# EAGLE design manpad (EAGLE 7.5.0)

## Sheet 1 of 5: MPU MAIN
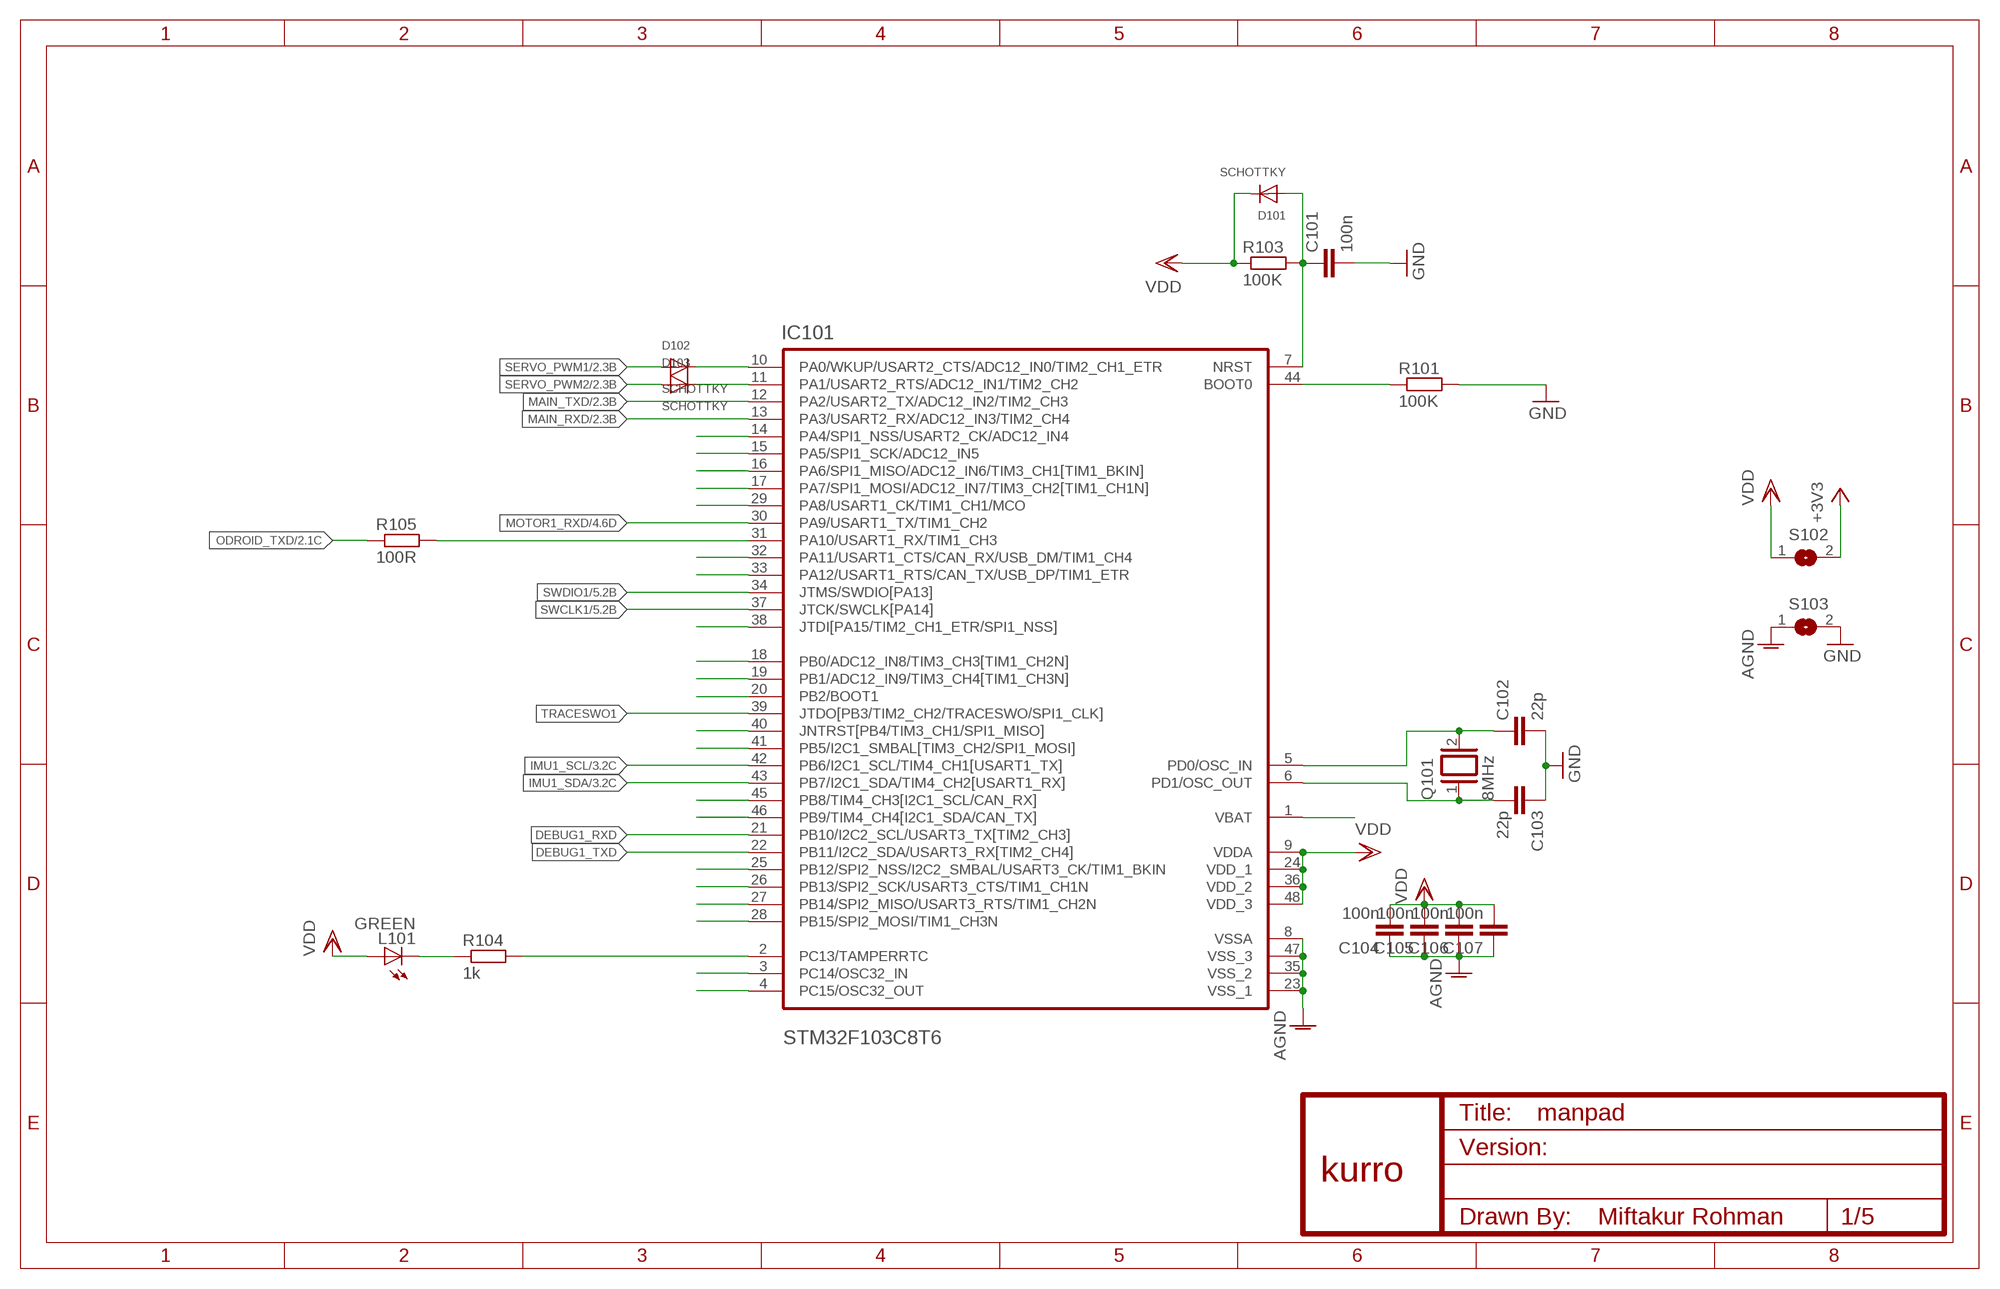
[diagram p0: schematic, sheet 1]

### Parts
C101  100n  C-EUC0603  [C0603]
C102  22p  C-EUC0603  [C0603]
C103  22p  C-EUC0603  [C0603]
C104  100n  C-EUC0603  [C0603]
C105  100n  C-EUC0603  [C0603]
C106  100n  C-EUC0603  [C0603]
C107  100n  C-EUC0603  [C0603]
D101  SCHOTTKY  DIODESOD-323F  [SOD-323F]
D102  SCHOTTKY  DIODESOD-323F  [SOD-323F]
D103  SCHOTTKY  DIODESOD-323F  [SOD-323F]
IC101  STM32F103C8T6  [QFP50P900X900X160-48N]
L101  GREEN  LEDCHIP-LED0805  [CHIP-LED0805]
Q101  8MHz  XTAL/S  [QS]
R101  100K  R-EU_R0603  [R0603]
R103  100K  R-EU_R0603  [R0603]
R104  1k  R-EU_R0603  [R0603]
R105  100R  R-EU_R0603  [R0603]
S102  SJS  [SJS]
S103  SJS  [SJS]
U$1  KURRO_FOOTPRINT  [KURRO-LOGO]

### Nets
+3V3: S102.2 ; also sheet 2,3,4,5
AGND [ic]: C104.1 C105.1 C106.1 C107.1 IC101.8(VSSA) IC101.23(VSS_1) IC101.35(VSS_2) IC101.47(VSS_3) S103.1 ; also sheet 2
DEBUG1_RXD [ic]: IC101.21(PB10/I2C2_SCL/USART3_TX[TIM2_CH3])
DEBUG1_TXD [ic]: IC101.22(PB11/I2C2_SDA/USART3_RX[TIM2_CH4])
GND: C101.2 C102.2 C103.1 R101.2 S103.2 ; also sheet 2,3,4,5
IMU1_SCL [ic]: IC101.42(PB6/I2C1_SCL/TIM4_CH1[USART1_TX]) ; also sheet 3
IMU1_SDA [ic]: IC101.43(PB7/I2C1_SDA/TIM4_CH2[USART1_RX]) ; also sheet 3
LED1_BUILTIN [ic]: IC101.2(PC13/TAMPERRTC) R104.2
MAIN_RXD [ic]: IC101.13(PA3/USART2_RX/ADC12_IN3/TIM2_CH4) ; also sheet 2,5
MAIN_TXD [ic]: IC101.12(PA2/USART2_TX/ADC12_IN2/TIM2_CH3) ; also sheet 2,5
MOTOR1_RXD [ic]: IC101.30(PA9/USART1_TX/TIM1_CH2) ; also sheet 4
N$2 [ic]: IC101.45(PB8/TIM4_CH3[I2C1_SCL/CAN_RX])
N$4 [ic]: IC101.44(BOOT0) R101.1
N$5 [ic]: IC101.20(PB2/BOOT1)
N$6 [ic]: C103.2 IC101.6(PD1/OSC_OUT) Q101.1
N$7 [ic]: C102.1 IC101.5(PD0/OSC_IN) Q101.2
N$8 [ic]: IC101.46(PB9/TIM4_CH4[I2C1_SDA/CAN_TX])
N$9 [ic]: L101.C R104.1
N$40 [ic]: IC101.14(PA4/SPI1_NSS/USART2_CK/ADC12_IN4)
N$41 [ic]: IC101.15(PA5/SPI1_SCK/ADC12_IN5)
N$42 [ic]: IC101.16(PA6/SPI1_MISO/ADC12_IN6/TIM3_CH1[TIM1_BKIN])
N$43 [ic]: IC101.17(PA7/SPI1_MOSI/ADC12_IN7/TIM3_CH2[TIM1_CH1N])
N$44 [ic]: IC101.29(PA8/USART1_CK/TIM1_CH1/MCO)
N$45 [ic]: IC101.32(PA11/USART1_CTS/CAN_RX/USB_DM/TIM1_CH4)
N$46 [ic]: IC101.33(PA12/USART1_RTS/CAN_TX/USB_DP/TIM1_ETR)
N$47 [ic]: IC101.38(JTDI[PA15/TIM2_CH1_ETR/SPI1_NSS])
N$48 [ic]: IC101.18(PB0/ADC12_IN8/TIM3_CH3[TIM1_CH2N])
N$49 [ic]: IC101.19(PB1/ADC12_IN9/TIM3_CH4[TIM1_CH3N])
N$50 [ic]: IC101.40(JNTRST[PB4/TIM3_CH1/SPI1_MISO])
N$51 [ic]: IC101.41(PB5/I2C1_SMBAL[TIM3_CH2/SPI1_MOSI])
N$52 [ic]: IC101.25(PB12/SPI2_NSS/I2C2_SMBAL/USART3_CK/TIM1_BKIN)
N$53 [ic]: IC101.26(PB13/SPI2_SCK/USART3_CTS/TIM1_CH1N)
N$54 [ic]: IC101.27(PB14/SPI2_MISO/USART3_RTS/TIM1_CH2N)
N$55 [ic]: IC101.28(PB15/SPI2_MOSI/TIM1_CH3N)
N$56 [ic]: IC101.3(PC14/OSC32_IN)
N$57 [ic]: IC101.4(PC15/OSC32_OUT)
N$58 [ic]: IC101.1(VBAT)
N$59 [ic]: IC101.31(PA10/USART1_RX/TIM1_CH3) R105.2
ODROID_TXD: R105.1 ; also sheet 2,4
PWM1_1 [ic]: D102.C IC101.10(PA0/WKUP/USART2_CTS/ADC12_IN0/TIM2_CH1_ETR)
PWM2_1 [ic]: D103.C IC101.11(PA1/USART2_RTS/ADC12_IN1/TIM2_CH2)
RST [ic]: C101.1 D101.A IC101.7(NRST) R103.2
SERVO_PWM1: D102.A ; also sheet 2,4,5
SERVO_PWM2: D103.A ; also sheet 2,4,5
SWCLK1 [ic]: IC101.37(JTCK/SWCLK[PA14]) ; also sheet 5
SWDIO1 [ic]: IC101.34(JTMS/SWDIO[PA13]) ; also sheet 5
TRACESWO1 [ic]: IC101.39(JTDO[PB3/TIM2_CH2/TRACESWO/SPI1_CLK])
VDD [ic]: C104.2 C105.2 C106.2 C107.2 D101.C IC101.9(VDDA) IC101.24(VDD_1) IC101.36(VDD_2) IC101.48(VDD_3) L101.A R103.1 S102.1 ; also sheet 2

## Sheet 2 of 5: MPU REDUNDANT
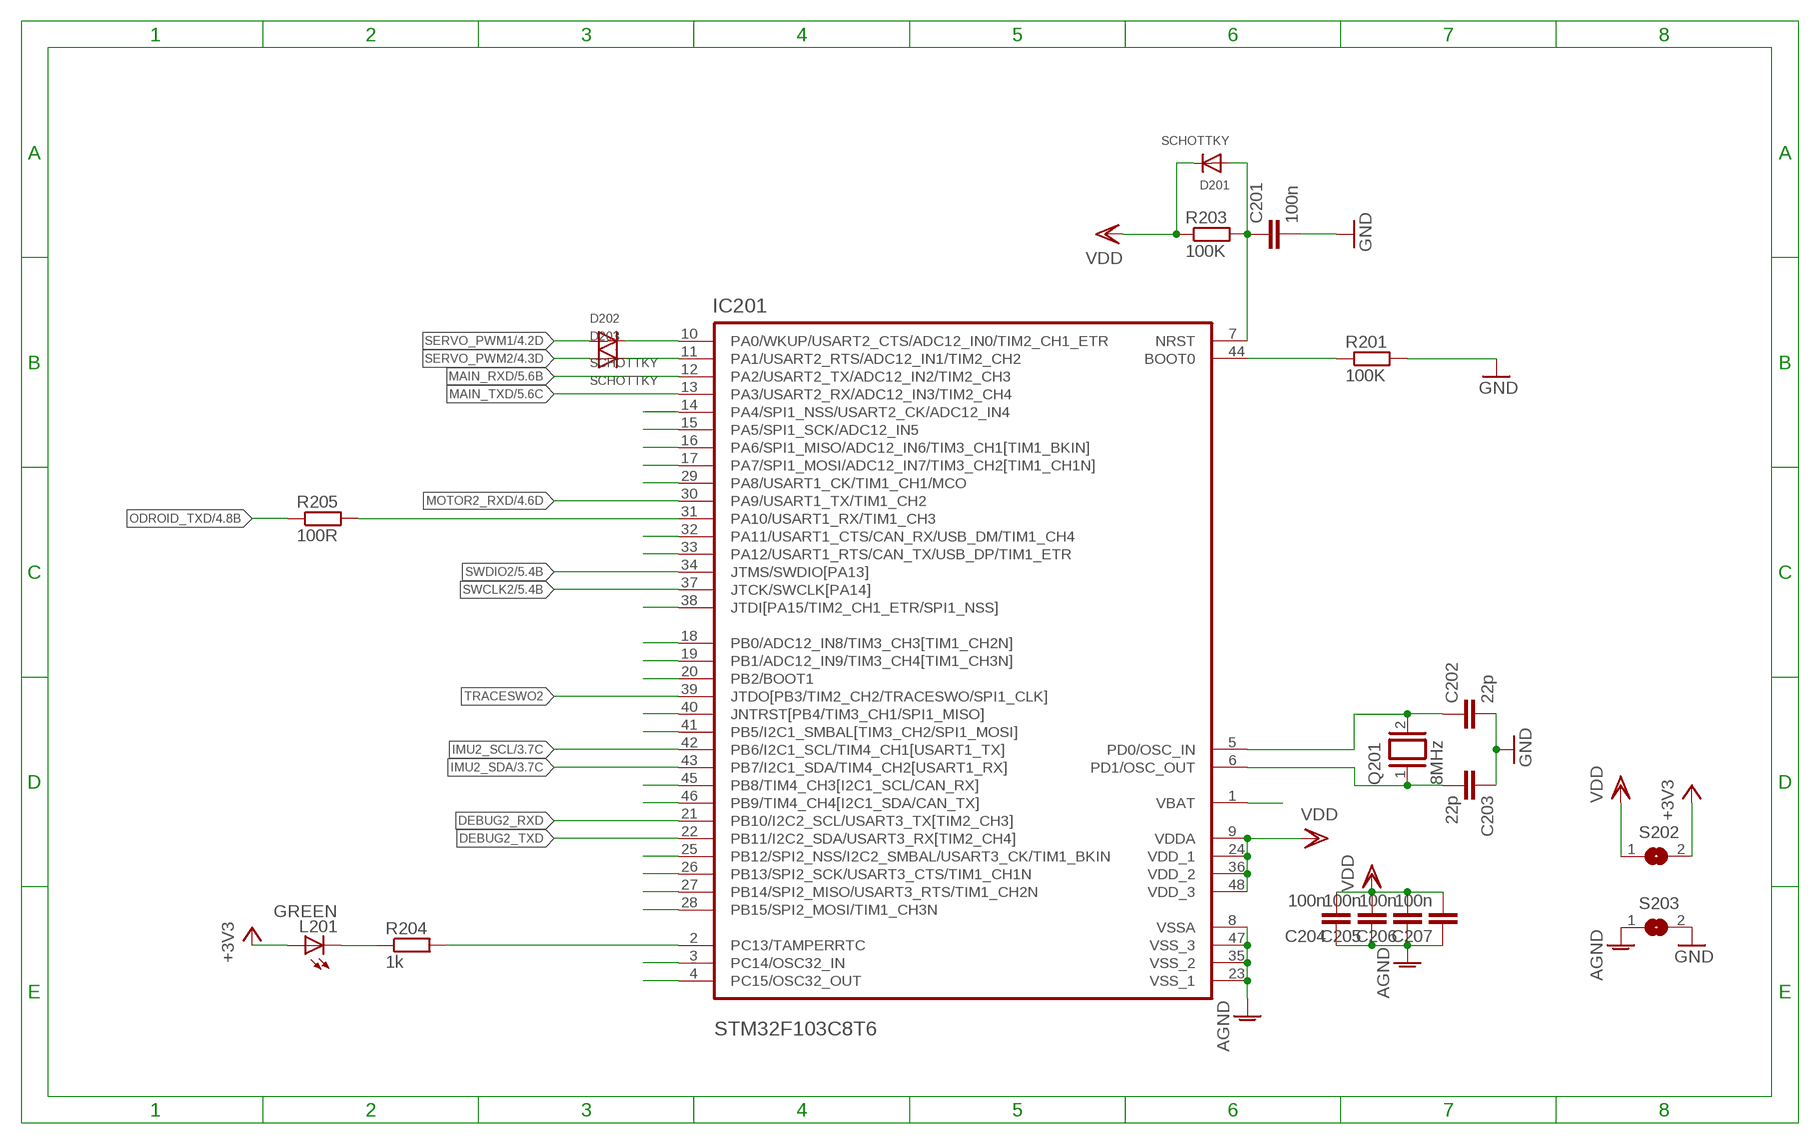
[diagram p1: schematic, sheet 2]

### Parts
C201  100n  C-EUC0603  [C0603]
C202  22p  C-EUC0603  [C0603]
C203  22p  C-EUC0603  [C0603]
C204  100n  C-EUC0603  [C0603]
C205  100n  C-EUC0603  [C0603]
C206  100n  C-EUC0603  [C0603]
C207  100n  C-EUC0603  [C0603]
D201  SCHOTTKY  DIODESOD-323F  [SOD-323F]
D202  SCHOTTKY  DIODESOD-323F  [SOD-323F]
D203  SCHOTTKY  DIODESOD-323F  [SOD-323F]
IC201  STM32F103C8T6  [QFP50P900X900X160-48N]
L201  GREEN  LEDCHIP-LED0805  [CHIP-LED0805]
Q201  8MHz  XTAL/S  [QS]
R201  100K  R-EU_R0603  [R0603]
R203  100K  R-EU_R0603  [R0603]
R204  1k  R-EU_R0603  [R0603]
R205  100R  R-EU_R0603  [R0603]
S202  SJS  [SJS]
S203  SJS  [SJS]

### Nets
+3V3: L201.A S202.2 ; also sheet 1,3,4,5
AGND [ic]: C204.1 C205.1 C206.1 C207.1 IC201.8(VSSA) IC201.23(VSS_1) IC201.35(VSS_2) IC201.47(VSS_3) S203.1 ; also sheet 1
DEBUG2_RXD [ic]: IC201.21(PB10/I2C2_SCL/USART3_TX[TIM2_CH3])
DEBUG2_TXD [ic]: IC201.22(PB11/I2C2_SDA/USART3_RX[TIM2_CH4])
GND: C201.2 C202.2 C203.1 R201.2 S203.2 ; also sheet 1,3,4,5
IMU2_SCL [ic]: IC201.42(PB6/I2C1_SCL/TIM4_CH1[USART1_TX]) ; also sheet 3
IMU2_SDA [ic]: IC201.43(PB7/I2C1_SDA/TIM4_CH2[USART1_RX]) ; also sheet 3
LED2_BUILTIN [ic]: IC201.2(PC13/TAMPERRTC) R204.2
MAIN_RXD [ic]: IC201.12(PA2/USART2_TX/ADC12_IN2/TIM2_CH3) ; also sheet 1,5
MAIN_TXD [ic]: IC201.13(PA3/USART2_RX/ADC12_IN3/TIM2_CH4) ; also sheet 1,5
MOTOR2_RXD [ic]: IC201.30(PA9/USART1_TX/TIM1_CH2) ; also sheet 4
N$1 [ic]: IC201.44(BOOT0) R201.1
N$3 [ic]: IC201.20(PB2/BOOT1)
N$13 [ic]: IC201.45(PB8/TIM4_CH3[I2C1_SCL/CAN_RX])
N$14 [ic]: IC201.46(PB9/TIM4_CH4[I2C1_SDA/CAN_TX])
N$17 [ic]: C203.2 IC201.6(PD1/OSC_OUT) Q201.1
N$18 [ic]: C202.1 IC201.5(PD0/OSC_IN) Q201.2
N$20 [ic]: L201.C R204.1
N$21 [ic]: IC201.14(PA4/SPI1_NSS/USART2_CK/ADC12_IN4)
N$22 [ic]: IC201.15(PA5/SPI1_SCK/ADC12_IN5)
N$23 [ic]: IC201.16(PA6/SPI1_MISO/ADC12_IN6/TIM3_CH1[TIM1_BKIN])
N$24 [ic]: IC201.17(PA7/SPI1_MOSI/ADC12_IN7/TIM3_CH2[TIM1_CH1N])
N$25 [ic]: IC201.29(PA8/USART1_CK/TIM1_CH1/MCO)
N$26 [ic]: IC201.32(PA11/USART1_CTS/CAN_RX/USB_DM/TIM1_CH4)
N$27 [ic]: IC201.33(PA12/USART1_RTS/CAN_TX/USB_DP/TIM1_ETR)
N$28 [ic]: IC201.38(JTDI[PA15/TIM2_CH1_ETR/SPI1_NSS])
N$29 [ic]: IC201.18(PB0/ADC12_IN8/TIM3_CH3[TIM1_CH2N])
N$30 [ic]: IC201.19(PB1/ADC12_IN9/TIM3_CH4[TIM1_CH3N])
N$31 [ic]: IC201.40(JNTRST[PB4/TIM3_CH1/SPI1_MISO])
N$32 [ic]: IC201.41(PB5/I2C1_SMBAL[TIM3_CH2/SPI1_MOSI])
N$33 [ic]: IC201.25(PB12/SPI2_NSS/I2C2_SMBAL/USART3_CK/TIM1_BKIN)
N$34 [ic]: IC201.26(PB13/SPI2_SCK/USART3_CTS/TIM1_CH1N)
N$35 [ic]: IC201.27(PB14/SPI2_MISO/USART3_RTS/TIM1_CH2N)
N$36 [ic]: IC201.28(PB15/SPI2_MOSI/TIM1_CH3N)
N$37 [ic]: IC201.3(PC14/OSC32_IN)
N$38 [ic]: IC201.4(PC15/OSC32_OUT)
N$39 [ic]: IC201.1(VBAT)
N$60 [ic]: IC201.31(PA10/USART1_RX/TIM1_CH3) R205.2
ODROID_TXD: R205.1 ; also sheet 1,4
PWM1_2 [ic]: D202.C IC201.10(PA0/WKUP/USART2_CTS/ADC12_IN0/TIM2_CH1_ETR)
PWM2_2 [ic]: D203.C IC201.11(PA1/USART2_RTS/ADC12_IN1/TIM2_CH2)
RST1 [ic]: C201.1 D201.A IC201.7(NRST) R203.2
SERVO_PWM1: D202.A ; also sheet 1,4,5
SERVO_PWM2: D203.A ; also sheet 1,4,5
SWCLK2 [ic]: IC201.37(JTCK/SWCLK[PA14]) ; also sheet 5
SWDIO2 [ic]: IC201.34(JTMS/SWDIO[PA13]) ; also sheet 5
TRACESWO2 [ic]: IC201.39(JTDO[PB3/TIM2_CH2/TRACESWO/SPI1_CLK])
VDD [ic]: C204.2 C205.2 C206.2 C207.2 D201.C IC201.9(VDDA) IC201.24(VDD_1) IC201.36(VDD_2) IC201.48(VDD_3) R203.1 S202.1 ; also sheet 1

## Sheet 3 of 5: SENSOR & SERVO
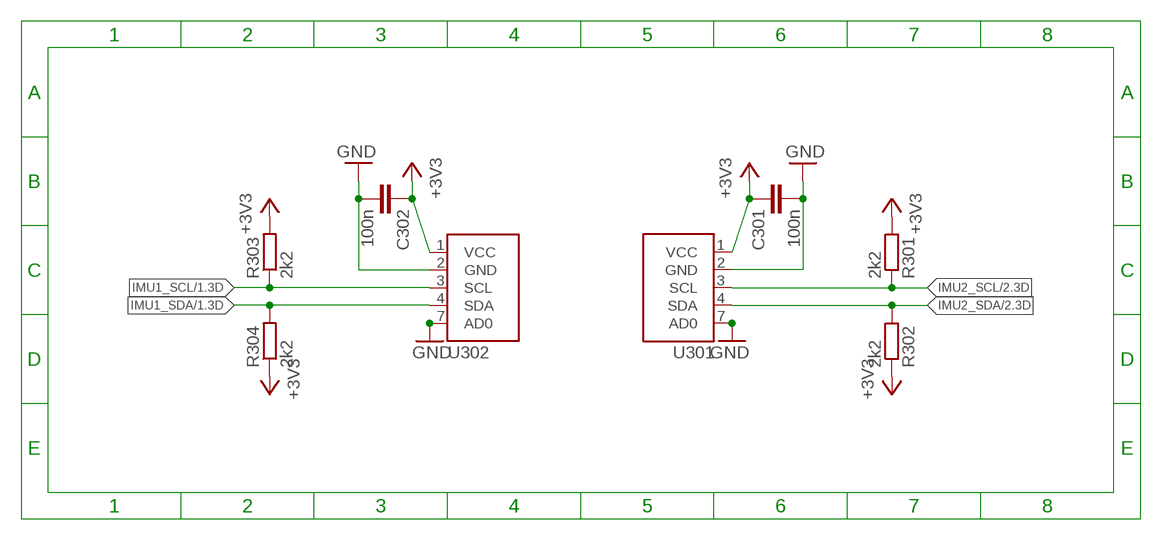
[diagram p2: schematic, sheet 3]

### Parts
C301  100n  C-EUC0603  [C0603]
C302  100n  C-EUC0603  [C0603]
R301  2k2  R-EU_R0603  [R0603]
R302  2k2  R-EU_R0603  [R0603]
R303  2k2  R-EU_R0603  [R0603]
R304  2k2  R-EU_R0603  [R0603]
U301  GY-521_MIN  [GY-521_MINNH]
U302  GY-521_MIN  [GY-521_MINNH]

### Nets
+3V3: C301.1 C302.1 R301.2 R302.1 R303.2 R304.1 U301.1(VCC) U302.1(VCC) ; also sheet 1,2,4,5
GND: C301.2 C302.2 U301.2(GND) U301.7(AD0) U302.2(GND) U302.7(AD0) ; also sheet 1,2,4,5
IMU1_SCL [ic]: R303.1 U302.3(SCL) ; also sheet 1
IMU1_SDA [ic]: R304.2 U302.4(SDA) ; also sheet 1
IMU2_SCL [ic]: R301.1 U301.3(SCL) ; also sheet 2
IMU2_SDA [ic]: R302.2 U301.4(SDA) ; also sheet 2

## Sheet 4 of 5: COMM & POWER
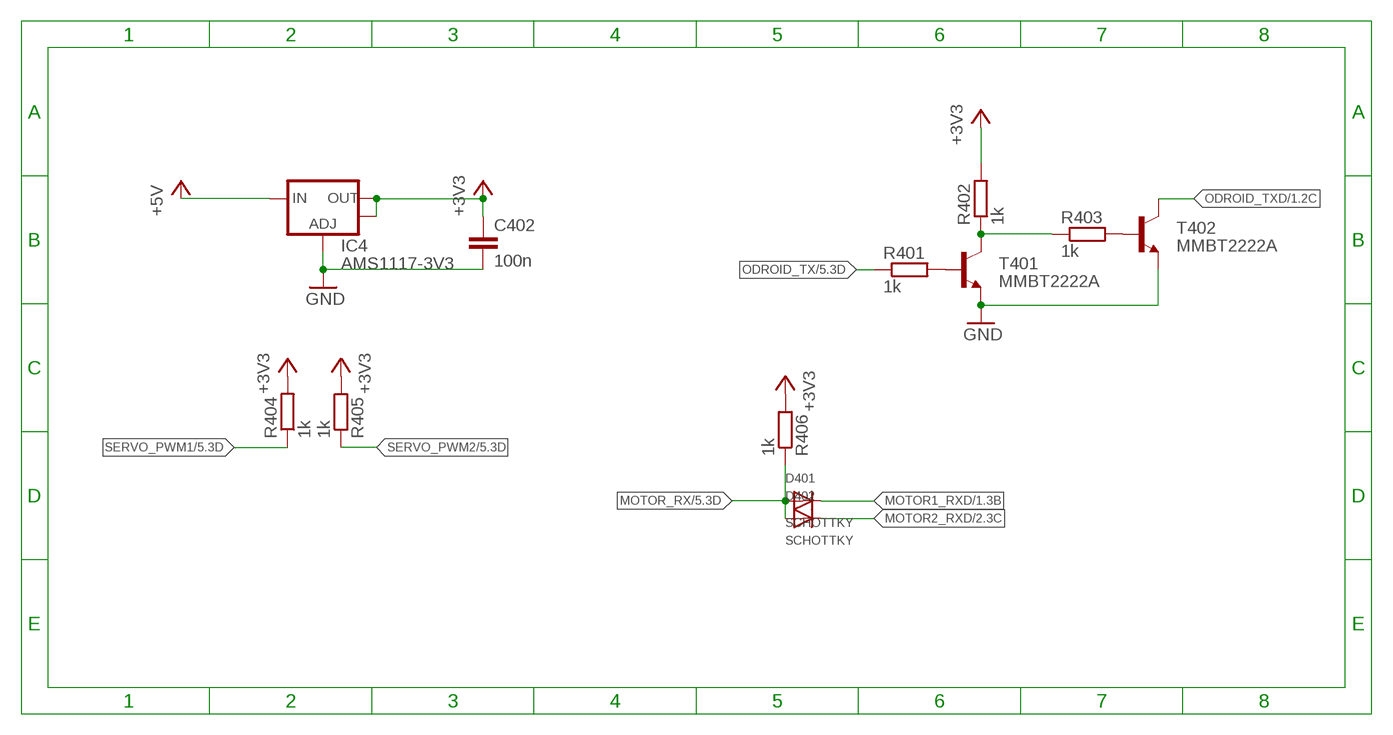
[diagram p3: schematic, sheet 4]

### Parts
C402  100n  C-EUC0603  [C0603]
D401  SCHOTTKY  DIODESOD-323F  [SOD-323F]
D402  SCHOTTKY  DIODESOD-323F  [SOD-323F]
IC4  AMS1117-3V3  V_REG_LM1117SOT223  [SOT223]
R401  1k  R-EU_R0603  [R0603]
R402  1k  R-EU_R0603  [R0603]
R403  1k  R-EU_R0603  [R0603]
R404  1k  R-EU_R0603  [R0603]
R405  1k  R-EU_R0603  [R0603]
R406  1k  R-EU_R0603  [R0603]
T401  MMBT2222A  TRANSISTOR_NPNSOT23  [SOT23]
T402  MMBT2222A  TRANSISTOR_NPNSOT23  [SOT23]

### Nets
+3V3: C402.1 IC4.2(OUT) IC4.4(OUT) R402.2 R404.2 R405.2 R406.2 ; also sheet 1,2,3,5
+5V [power]: IC4.3(IN) ; also sheet 5
GND: C402.2 IC4.1(ADJ) T401.2(E) T402.2(E) ; also sheet 1,2,3,5
MOTOR1_RXD [ic]: D401.C ; also sheet 1
MOTOR2_RXD [ic]: D402.C ; also sheet 2
MOTOR_RX [ic]: D401.A D402.A R406.1 ; also sheet 5
N$10: R401.2 T401.1(B)
N$11: R402.1 R403.1 T401.3(C)
N$12: R403.2 T402.1(B)
ODROID_TX: R401.1 ; also sheet 5
ODROID_TXD: T402.3(C) ; also sheet 1,2
SERVO_PWM1: R404.1 ; also sheet 1,2,5
SERVO_PWM2: R405.1 ; also sheet 1,2,5

## Sheet 5 of 5: CONNECTOR
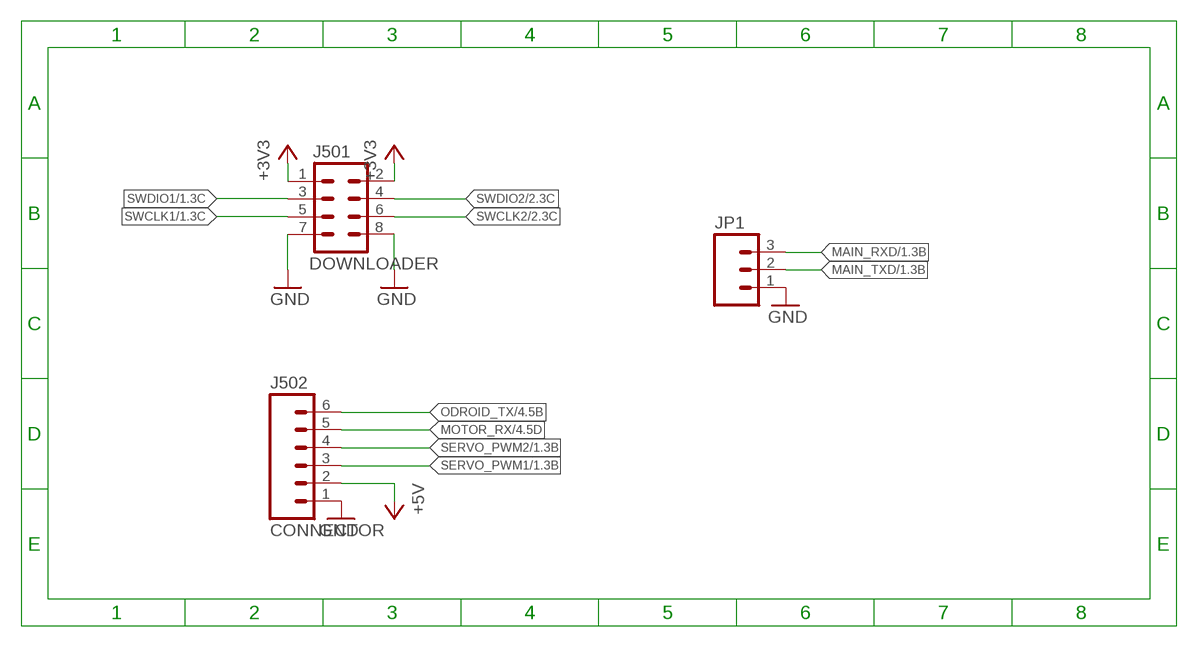
[diagram p4: schematic, sheet 5]

### Parts
J501  DOWNLOADER  M04X2FEMALE_SMD  [2X4_SMD]
J502  CONNECTOR  M06-XH-RA  [XH-6-RA]
JP1  M03LOCK  [1X03_LOCK]

### Nets
+3V3: J501.1 J501.2 ; also sheet 1,2,3,4
+5V [power]: J502.2 ; also sheet 4
GND: J501.7 J501.8 J502.1 JP1.1 ; also sheet 1,2,3,4
MAIN_RXD [ic]: JP1.3 ; also sheet 1,2
MAIN_TXD [ic]: JP1.2 ; also sheet 1,2
MOTOR_RX [ic]: J502.5 ; also sheet 4
ODROID_TX: J502.6 ; also sheet 4
SERVO_PWM1: J502.3 ; also sheet 1,2,4
SERVO_PWM2: J502.4 ; also sheet 1,2,4
SWCLK1 [ic]: J501.5 ; also sheet 1
SWCLK2 [ic]: J501.6 ; also sheet 2
SWDIO1 [ic]: J501.3 ; also sheet 1
SWDIO2 [ic]: J501.4 ; also sheet 2

## Library data of the parts
C101-C107 C201-C207 C301 C302 C402 = resistor:C-EU: CAPACITOR, European symbol
D101-D103 D201-D203 D401 D402 = adafruit:DIODE: Diode SMADIODE - SMA Surface Mount Package 20V 1A Schottky Diode Digikey: 641-1014-6-ND DO-1N4148 - Through Hole Small Current Diode SOD-123 20V 1 A (.5mV Vf) Schottky Diode - Digikey: MBRX120TPMSCT-ND SOD-323 10V 570mA (.38mV Vf, 3ns) Schottky Diode - Digikey: ZLLS410CT-ND SOD-523 30V 30mA Schottky Diode (RB751S-40TE61) - Digikey: RB751S-40TE61CT-ND SOT23-R/W - SOT23 Package (R = Solder Paste/Reflow Ovens, W = Hand-Soldering) BAT54Film 40V 300mA - Digikey: 497-7162-1-ND
IC4 = SparkFun:V_REG_LM1117: Voltage Regulator LM1117 Standard adjustable voltage regulator but in SMD form. Spark Fun Electronics SKU : COM-00595
IC101 IC201 = ST Microelctronics_By_element14_Batch_1:STM32F103C8T6: Medium-density performance line ARM-based 32-bit MCU; MPN: STM32F103CBT6; OC_FARNELL: 1606327; OC_NEWARK: 11N8296; PACKAGE: QFP-48; SUPPLIER: STMICROELECTRONICS
J501 = SparkFun-Connectors:M04X2: .1" header, two rows of four.
J502 = SparkFun-Connectors:M06: Header 6 Standard 6-pin 0.1" header. Use with straight break away headers (SKU : PRT-00116), right angle break away headers (PRT-00553), swiss pins (PRT-00743), machine pins (PRT-00117), and female headers (PRT-00115). Molex polarized connector foot print use with SKU : PRT-08094 with associated crimp pins and housings. NOTES ON THE VARIANTS LOCK and LOCK_LONGPADS... This footprint was designed to help hold the alignment of a through-hole component (i.e. 6-pin header) while soldering it into place. You may notice that each hole has been shifted either up or down by 0.005 of an inch from it's more standard position (which is a perfectly straight line). This slight alteration caused the pins (the squares in the middle) to touch the edges of the holes. Because they are alternating, it causes a "brace" to hold the component in place. 0.005 has proven to be the perfect amount of "off-center" position when using our standard breakaway headers. Although looks a little odd when you look at the bare footprint, once you have a header in there, the alteration is very hard to notice. Also,if you push a header all the way into place, it is covered up entirely on the bottom side. This idea of altering the position of holes to aid alignment will be further integrated into the Sparkfun Library for other footprints. It can help hold any component with 3 or more connection pins.
JP1 = SparkFun-Connectors:M03: Header 3 Standard 3-pin 0.1" header. Use with straight break away headers (SKU : PRT-00116), right angle break away headers (PRT-00553), swiss pins (PRT-00743), machine pins (PRT-00117), and female headers (PRT-00115). Molex polarized connector foot print use with SKU : PRT-08232 with associated crimp pins and housings.
L101 L201 = led:LED: LED OSRAM: - CHIPLED LG R971, LG N971, LY N971, LG Q971, LY Q971, LO R971, LY R971 LH N974, LH R974 LS Q976, LO Q976, LY Q976 LO Q996 - Hyper CHIPLED LW Q18S LB Q993, LB Q99A, LB R99A - SideLED LS A670, LO A670, LY A670, LG A670, LP A670 LB A673, LV A673, LT A673, LW A673 LH A674 LY A675 LS A676, LA A676, LO A676, LY A676, LW A676 LS A679, LY A679, LG A679 - Hyper Micro SIDELED® LS Y876, LA Y876, LO Y876, LY Y876 LT Y87S - SmartLED LW L88C, LW L88S LB L89C, LB L89S, LG L890 LS L89K, LO L89K, LY L89K LS L896, LA L896, LO L896, LY L896 - TOPLED LS T670, LO T670, LY T670, LG T670, LP T670 LSG T670, LSP T670, LSY T670, LOP T670, LYG T670 LG T671, LOG T671, LSG T671 LB T673, LV T673, LT T673, LW T673 LH T674 LS T676, LA T676, LO T676, LY T676, LB T676, LH T676, LSB T676, LW T676 LB T67C, LV T67C, LT T67C, LS T67K, LO T67K, LY T67K, LW E67C LS E67B, LA E67B, LO E67B, LY E67B, LB E67C, LV E67C, LT E67C LW T67C LS T679, LY T679, LG T679 LS T770, LO T770, LY T770, LG T770, LP T770 LB T773, LV T773, LT T773, LW T773 LH T774 LS E675, LA E675, LY E675, LS T675 LS T776, LA T776, LO T776, LY T776, LB T776 LHGB T686 LT T68C, LB T68C - Hyper Mini TOPLED® LB M676 - Mini TOPLED Santana® LG M470 LS M47K, LO M47K, LY M47K Source: http://www.osram.convergy.de LUXEON: - LUMILED® LXK2-PW12-R00, LXK2-PW12-S00, LXK2-PW14-U00, LXK2-PW14-V00 LXK2-PM12-R00, LXK2-PM12-S00, LXK2-PM14-U00 LXK2-PE12-Q00, LXK2-PE12-R00, LXK2-PE12-S00, LXK2-PE14-T00, LXK2-PE14-U00 LXK2-PB12-K00, LXK2-PB12-L00, LXK2-PB12-M00, LXK2-PB14-N00, LXK2-PB14-P00, LXK2-PB14-Q00 LXK2-PR12-L00, LXK2-PR12-M00, LXK2-PR14-Q00, LXK2-PR14-R00 LXK2-PD12-Q00, LXK2-PD12-R00, LXK2-PD12-S00 LXK2-PH12-R00, LXK2-PH12-S00 LXK2-PL12-P00, LXK2-PL12-Q00, LXK2-PL12-R00 Source: www.luxeon.com KINGBRIGHT: KA-3528ASYC Source: www.kingbright.com
Q101 Q201 = special:XTAL/S: CRYSTAL
R101 R103-R105 R201 R203-R205 R301-R304 R401-R406 = resistor:R-EU_: RESISTOR, European symbol
S102 S103 S202 S203 = jumper:SJ: SMD solder JUMPER
T401 T402 = SparkFun-DiscreteSemi:TRANSISTOR_NPN: Generic NPN BJT MMBT2222A - TRANS-08049 (SOT-23, 1A 40V) MPSA42 - TRANS-09116 (SOT-23, 500mA 300V) MMBT5088LT1G - TRANS-11160 (SOT-23, 50 mA 30V)
U301 U302 = SparkFun-Boards:GY-521_MIN
U$1 = SparkFun:KURRO_FOOTPRINT

## Net classes
0 default: width 0.305 mm, drill 0.59 mm, clearance 0.254 mm
1 ic: width 0.254 mm, drill 0.59 mm, clearance 0.203 mm
2 power: width 0.406 mm, drill 0.59 mm, clearance 0.305 mm

## Board
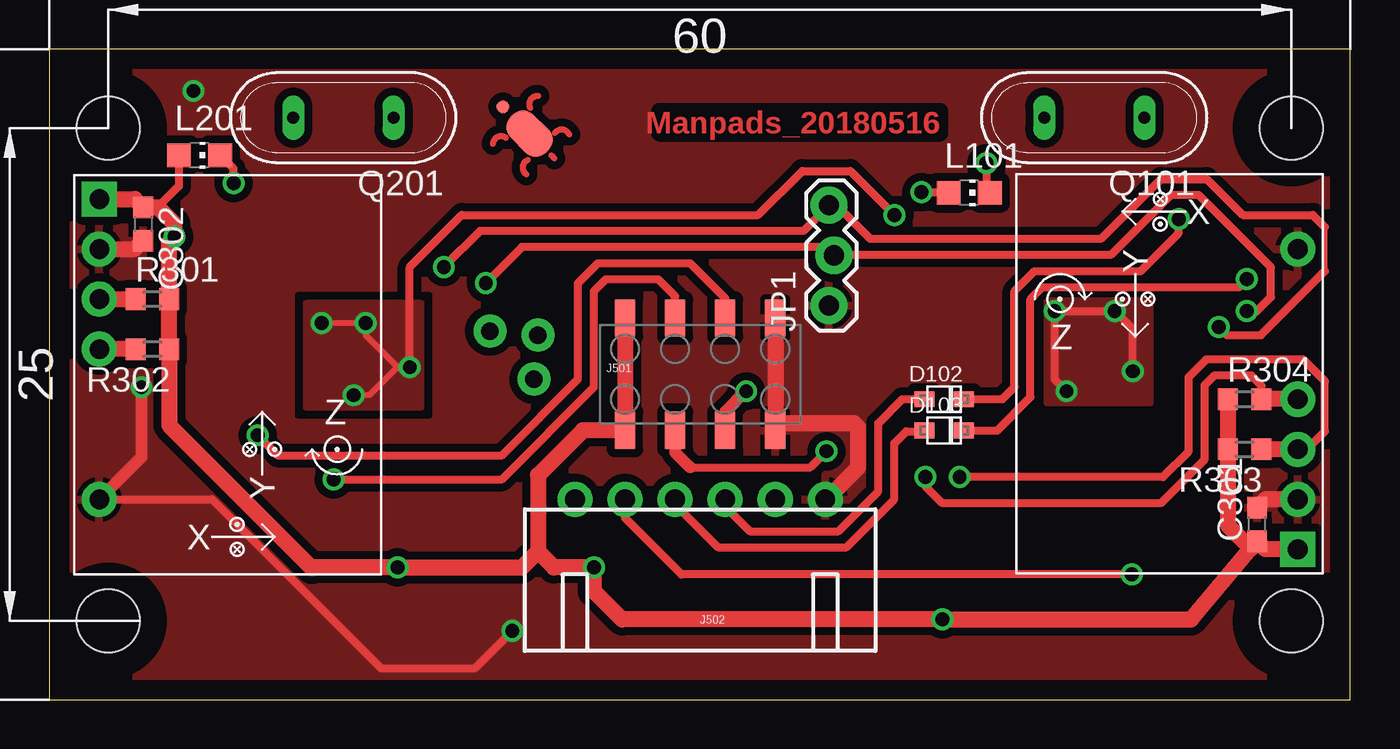
[diagram p5: board, top side]
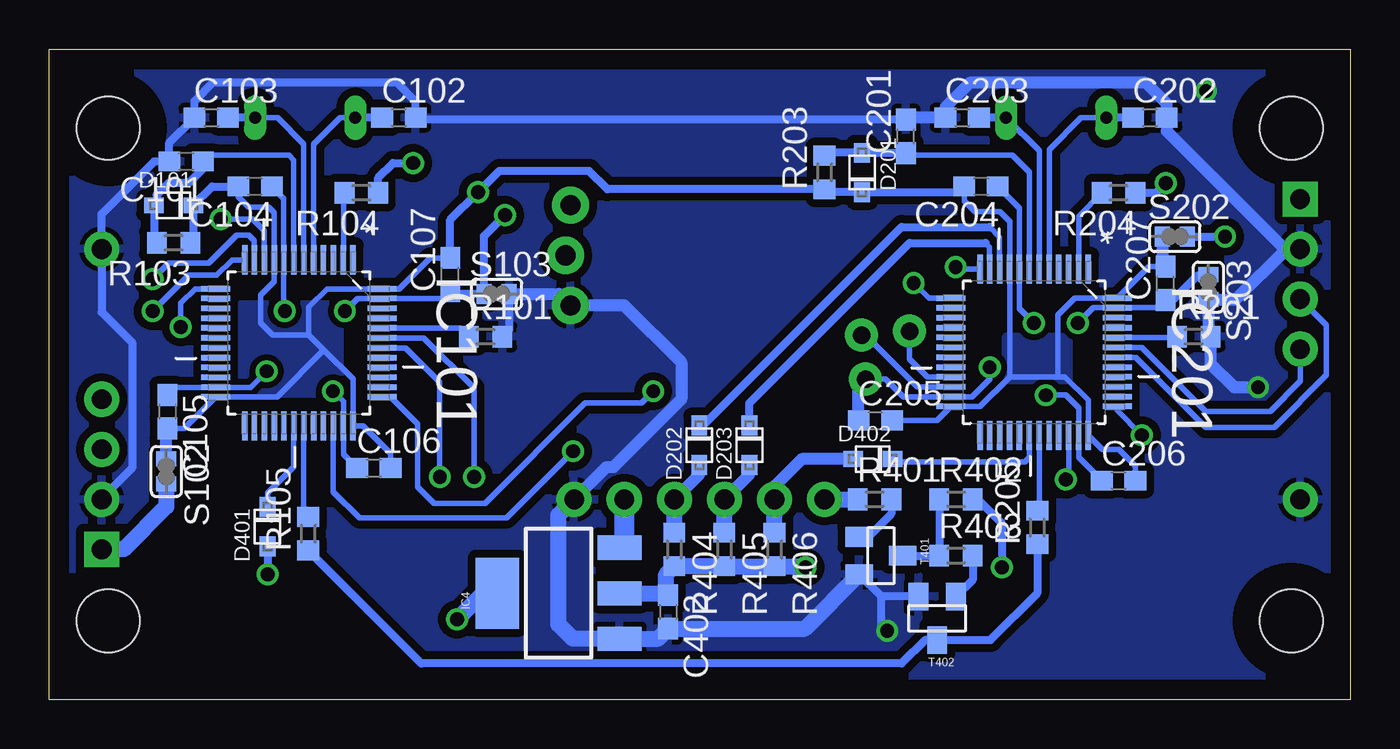
[diagram p6: board, bottom side, seen from below]

Size 66 x 33 mm. Coordinates in mm from the lower left corner, seen from the top.
Outline: 0,0 66,0 66,33 0,33 0,0
Copper layers (1*16): Top 0.035mm / dielectric 1.5mm / Bottom 0.035mm
Design rules "default": minimum track width 10mil, minimum drill 24mil, track to track 8mil, track to pad 8mil, pad to pad 8mil, via to via 8mil, smd to smd 8mil, copper to edge 40mil, drill to drill 8mil, minimum pad ring 10mil, minimum via ring 8mil, stop-mask expansion 4mil, vias tented up to drill 0mil, thermal gap 10mil
Holes 3.2 mm at 3,4 63,4 3,29 63,29
tRestrict: area 0.5,1.5 to 5.5,6.5; area 60.5,1.5 to 65.5,6.5; area 60.5,26.5 to 65.5,31.5; area 0.5,26.5 to 5.5,31.5
bRestrict: area 0.5,1.5 to 5.5,6.5; area 60.5,1.5 to 65.5,6.5; area 60.5,26.5 to 65.5,31.5; area 0.5,26.5 to 5.5,31.5

### Footprints (pad centres in the part's own frame; a part is rotated, then mirrored left to right if it is on the bottom)
C0603 = smd 1.1 x 1: 1 -0.85,0; 2 0.85,0
SOD-323F = smd 1 x 0.8: A -1,0; C 1,0
SOT223 = smd 1.219 x 2.235: 1 -2.311,-3.099; 2 0,-3.099; 3 2.311,-3.099 | smd 3.6 x 2.2: 4 0,3.099
QFP50P900X900X160-48N = smd 1.473 x 0.279: 1 -4.216,2.743; 2 -4.216,2.261; 3 -4.216,1.753; 4 -4.216,1.245; 5 -4.216,0.762; 6 -4.216,0.254; 7 -4.216,-0.254; 8 -4.216,-0.762; 9 -4.216,-1.245; 10 -4.216,-1.753; 11 -4.216,-2.261; 12 -4.216,-2.743; 25 4.216,-2.743; 26 4.216,-2.261; 27 4.216,-1.753; 28 4.216,-1.245; 29 4.216,-0.762; 30 4.216,-0.254; 31 4.216,0.254; 32 4.216,0.762; 33 4.216,1.245; 34 4.216,1.753; 35 4.216,2.261; 36 4.216,2.743 | smd 0.279 x 1.473: 13 -2.743,-4.216; 14 -2.261,-4.216; 15 -1.753,-4.216; 16 -1.245,-4.216; 17 -0.762,-4.216; 18 -0.254,-4.216; 19 0.254,-4.216; 20 0.762,-4.216; 21 1.245,-4.216; 22 1.753,-4.216; 23 2.261,-4.216; 24 2.743,-4.216; 37 2.743,4.216; 38 2.261,4.216; 39 1.753,4.216; 40 1.245,4.216; 41 0.762,4.216; 42 0.254,4.216; 43 -0.254,4.216; 44 -0.762,4.216; 45 -1.245,4.216; 46 -1.753,4.216; 47 -2.261,4.216; 48 -2.743,4.216
2X4_SMD = smd 1.02 x 1.9: 1 -3.81,-2.85; 2 -3.81,2.85; 3 -1.27,-2.85; 4 -1.27,2.85; 5 1.27,-2.85; 6 1.27,2.85; 7 3.81,-2.85; 8 3.81,2.85
XH-6-RA = drill 1 pad 1.778: 1 -6.35,0; 2 -3.81,0; 3 -1.27,0; 4 1.27,0; 5 3.81,0; 6 6.35,0
1X03_LOCK = drill 1.016 pad 1.88: 1 0,0.127; 2 2.54,-0.127; 3 5.08,0.127
CHIP-LED0805 = smd 1.2 x 1.2: A 0,-1.05; C 0,1.05
QS = drill 0.61 long: 1 -2.54,0; 2 2.54,0
R0603 = smd 1 x 1.1: 1 -0.85,0; 2 0.85,0
SJS = smd 0.762 x 1.016: 1 -0.635,0; 2 0.635,0
SOT23 = smd 1 x 1.4: 1 -0.95,-1.1; 2 0.95,-1.1; 3 0,1.1
GY-521_MINNH = drill 1 pad 1.778 square: 1 1.27,19.05 | drill 1 pad 1.778: 2 1.27,16.51; 3 1.27,13.97; 4 1.27,11.43; 7 1.27,3.81
KURRO-LOGO = smd 2.54 x 1.651 rotated 45 bottom: P$1 0,0 | smd 0.635 x 0.635 rotated 45 bottom: P$2 1.347,1.347

### Placement (x,y rotation side)
C101  59.05,27.3 180 bottom
C102  48.26,29.53 0 bottom
C103  57.78,29.53 0 bottom
C104  55.56,26.04 180 bottom
C105  60.01,14.61 270 bottom
C106  49.53,11.75 0 bottom
C107  45.66,21.56 90 bottom
C201  22.54,28.57 90 bottom
C202  10.16,29.53 0 bottom
C203  19.68,29.53 0 bottom
C204  18.73,26.04 180 bottom
C205  24.09,14.16 0 bottom
C206  11.75,11.11 0 bottom
C207  9.37,21.12 90 bottom
C301  61.28,8.89 90 top
C302  4.76,24.13 270 top
C402  34.61,4.45 270 bottom
D101  59.69,25.08 0 bottom
D102  45.4,15.24 0 top
D103  45.4,13.65 0 top
D201  24.77,26.75 270 bottom
D202  33.02,12.9 90 bottom
D203  30.48,12.9 90 bottom
D401  54.93,8.78 90 bottom
D402  24.22,12.2 0 bottom
IC4  40.16,5.4 90 bottom
IC101  53.34,18.1 270 bottom
IC201  16.03,17.62 270 bottom
J501  33.02,16.51 0 top
J502  33.02,10.16 180 top
JP1  39.69,20 90 top
L101  46.67,25.72 270 top
L201  7.62,27.62 270 top
Q101  53.02,29.53 180 top
Q201  14.92,29.53 180 top
R101  43.87,18.41 0 bottom
R103  59.69,23.18 180 bottom
R104  50.16,25.72 180 bottom
R105  52.86,8.41 90 bottom
R201  7.94,18.41 0 bottom
R203  26.67,26.75 90 bottom
R204  11.75,25.72 180 bottom
R205  15.88,8.73 90 bottom
R301  5.24,20.32 0 top
R302  5.24,17.78 180 top
R303  60.64,12.7 180 top
R304  60.64,15.24 0 top
R401  24.13,10.16 0 bottom
R402  20,10.16 0 bottom
R403  20,7.3 0 bottom
R404  34.29,7.62 270 bottom
R405  31.75,7.62 270 bottom
R406  29.21,7.62 270 bottom
S102  60.06,11.57 270 bottom
S103  43.31,20.59 0 bottom
S202  8.89,23.5 0 bottom
S203  7.2,20.93 270 bottom
T401  23.81,7.3 270 bottom
T402  20.95,4.13 180 bottom
U301  1.27,6.35 0 top
U302  64.61,26.67 180 top
U$1  24.36,28.73 0 bottom

### Tracks (layer width: path | path; a pad name or v marks a point on that pad's centre or on a via)
+3V3  (via drill 0.7, 0.7 pad 0.61)
  Top 0.406: C302.1 5.18,24.98 | L201.A 6.57,26.05 5.5,24.98
  Top 0.813: J501.2 J501.1 27.07,13.66 24.79,11.38 24.79,7.52 | U301.1 4.34,25.4 C302.1 5.5,24.98 6.35,24.13 v6.35,23.5 6.09,23.23 R301.2 R302.1 6.09,13.91 13.34,6.67 13.37,6.71 v17.68,6.71 23.98,6.71 24.79,7.52 | U302.1 61.7,7.62 C301.1 60.96,7.67 | R304.1 R303.2 59.79,8.84 60.96,7.67 | 24.79,7.52 25.6,6.71 v27.64,6.71 27.64,5.49 29.06,4.06 v45.31,4.06 57.94,4.06 60.96,7.67
  Bottom 0.406: S202.2 v6.35,23.5 | R402.2 18.9,10.16 17.68,8.94 v17.68,6.71
  Bottom 0.813: IC4.2 34.71,5.4 | 34.71,5.4 C402.1 | 34.71,5.4 34.71,6.35 R404.2 R405.2 R406.2 27.7,6.77 v27.64,6.71 | IC4.4 43.98,5.4 v45.31,4.06 | S102.2 60.06,9.79 62.23,7.62 U302.1
+5V
  Bottom 1.016: J502.2 36.83,7.94 IC4.3
AGND  (via drill 0.7, 0.7 pad 0.61, 0.9 pad 1.68)
  Top 0.279: v13.82,19.1 v16.05,19.1 16.05,18.49 17.68,16.87 16.26,15.44 v15.44,15.44
  Top 0.406: v51.61,15.65 51,16.26 v51,19.71 v54.05,19.71 54.97,18.8 v54.97,16.66 | 17.68,16.87 v18.29,16.87 18.29,21.95 20.93,24.59 35.97,24.59 38.2,26.82 40.64,26.82 v42.88,24.59
  Bottom 0.279: C204.1 16.8,24.95 IC201.8 16.8,19.84 v16.05,19.1 | C206.1 13.77,12.29 IC201.35 13.77,14.79 14.43,15.44 v15.44,15.44 | C107.1 46.01,20.36 IC101.47 50.35,20.36 v51,19.71 | C207.1 9.76,19.88 IC201.47 13.04,19.88 v13.82,19.1 | C105.1 59.63,15.84 IC101.23 55.79,15.84 v54.97,16.66 | v18.29,16.87 18.29,16.26 19.18,15.36 IC201.23 22.68,15.36 23.57,16.26 v24.59,16.26 | v54.05,19.71 54.1,20.17 IC101.8 54.1,25.42 C104.1 | v51.61,15.65 51.08,15.11 IC101.35 51.08,12.45 C106.1 | C205.1 24.94,14.48
  Bottom 0.406: C207.1 8.99,20.27 7.72,21.54 7.22,21.54 S203.1 | C107.1 45.53,20.59 S103.1 43.94,23.52 v42.88,24.59
  Bottom 0.61: 24.94,14.48 24.94,15.9 v24.59,16.26
  pour Top (isolate 0.305, rank 5): 13.21,14.83 18.9,14.83 18.9,20.12 13,20.12 13,14.83
  pour Top (isolate 0.305, rank 5): 50.6,15.04 55.88,15.04 55.88,20.52 50.6,20.52
DEBUG2_RXD  (via drill 0.9 pad 1.68)
  Bottom 0.279: IC201.21 21.46,16.38 22.35,17.27 v22.35,18.69
DEBUG2_TXD  (via drill 0.9 pad 1.68)
  Bottom 0.279: IC201.22 21.96,15.87 24.59,18.49 v24.79,18.49
GND  (via drill 0.7)
  Top 0.406: v23.5,3.49 21.59,1.59 16.83,1.59 8.26,10.16 U301.7
  Top 0.61: v4.67,15.85 4.67,12.29 U301.7
  Top 0.813: U301.2 4.34,22.86 C302.2 | U302.2 61.7,10.16 C301.2 | J501.8 J501.7 37.19,14.02 40.84,14.02 41.05,13.82 41.05,11.79 39.42,10.16 J502.1
  Bottom 0.406: 22.44,29.53 C201.2 47.31,29.43 C102.2 47.41,30.34 48.36,31.29 57.71,31.29 58.63,30.37 C103.1 59.91,28.26 C101.2 60.68,27.3 63.34,24.64 U302.7 63.34,19.65 61.77,18.09 61.77,11.79 63.34,10.22 U302.2 | T402.2 23.79,5.23 | 23.79,5.23 T401.2 | 3.25,22.86 3.32,22.86 | 7.2,18.53 R201.2 | J502.1 39.22,10.16 | v23.5,3.49 23.79,3.79 23.79,5.23 | S103.2 42.67,18.76 R101.2
  Bottom 0.61: 22.44,29.53 C203.1 20.54,30.06 19.3,31.29 10.36,31.29 9.31,30.24 C202.2 9.31,28.85 3.32,22.86 | U301.2 3.25,22.86 5.82,20.29 S203.2 7.2,18.53 | R201.2 7.09,17.04 5.89,15.85 v4.67,15.85 | J502.1 37.74,11.79 37.39,11.79 33.93,15.24 33.93,17.11 36.83,20 JP1.1 40.15,20.59 S103.2
  Bottom 0.813: J502.1 40.16,9.37 40.16,3.81 39.44,3.09 IC4.1 35.12,3.09 C402.2 27.67,3.6 T401.2
  other vias: 7.32,30.89
  pour Bottom (isolate 0.406, rank 6): 0,0 66,0 66,33 0,33
  pour Top (isolate 0.406, rank 6): 0,0 66,0 66,33 0,33
IMU1_SCL  (via drill 0.7)
  Top 0.406: U302.3 63.8,12.7 64.72,13.61 64.72,16.15 63.6,17.27 58.73,17.27 57.81,16.36 57.81,12.6 56.5,11.29 v46.19,11.29
  Top 0.813: U302.3 R303.1
  Bottom 0.279: IC101.42 47.92,17.84 46.19,16.12 v46.19,11.29
IMU1_SDA  (via drill 0.7)
  Top 0.406: R304.2 61.49,15.93 60.96,16.46 59.13,16.46 58.62,15.95 58.62,12.19 56.39,9.96 45.31,9.96 44.45,10.82 v44.45,11.29
  Top 0.813: U302.4 R304.2
  Bottom 0.279: IC101.43 47,18.35 44.45,15.8 v44.45,11.29
IMU2_SCL
  Top 0.813: U301.3 R301.1
  Bottom 0.279: IC201.42 10.87,17.37 7.32,13.82 3.86,13.82 1.22,16.46 1.22,19 U301.3
IMU2_SDA
  Top 0.813: R302.2 U301.4
  Bottom 0.279: IC201.43 10.56,17.88 7.32,14.63 4.06,14.63 2.54,16.15 U301.4
LED1_BUILTIN
  Bottom 0.279: IC101.2 51.08,25.65 R104.2
LED2_BUILTIN
  Bottom 0.279: IC201.2 13.77,24.54 R204.2
MAIN_RXD  (via drill 0.7)
  Top 0.305: 64.72,21.74 64.72,23.98
  Top 0.406: v59.33,18.9 59.74,18.49 61.47,18.49 64.72,21.74 | v20.02,21.95 21.84,23.77 38.25,23.77 JP1.3 39.94,25.08 41.66,23.37 53.34,23.37 56.39,26.42 58.73,26.42 60.55,24.59 64.11,24.59 64.72,23.98
  Bottom 0.279: IC101.13 58.61,20.84 59.33,20.12 v59.33,18.9 | IC201.12 19.91,21.84 v20.02,21.95
MAIN_TXD  (via drill 0.7)
  Top 0.406: v60.76,19.71 61.27,19.71 61.98,20.42 61.98,21.95 58.32,25.6 56.9,25.6 53.85,22.55 39.83,22.55 JP1.2 39.4,22.96 23.98,22.96 v22.15,21.13
  Bottom 0.279: IC101.12 56.73,22.31 57.51,21.54 58.93,21.54 v60.76,19.71 | IC201.13 21.38,20.36 v22.15,21.13
MOTOR1_RXD
  Bottom 0.279: IC101.30 53.59,11.81 54.93,10.48 D401.C
MOTOR2_RXD
  Bottom 0.279: IC201.30 16.29,12.29 16.51,12.06 23.08,12.06 D402.C
MOTOR_RX  (via drill 0.7)
  Top 0.406: v54.93,6.35 32.07,6.35 29.21,9.21 J502.5
  Bottom 0.406: D401.A v54.93,6.35
  Bottom 0.61: D402.A 27.83,12.21 29.21,10.82 J502.5
  Bottom 0.813: R406.1 J502.5
N$1
  Bottom 0.279: IC201.44 8.82,18.38 R201.1
N$4
  Bottom 0.279: IC101.44 45.16,18.86 R101.1
N$6
  Bottom 0.279: IC101.6 53.09,28.19 54.42,29.53 Q101.1 55.24,29.53
  Bottom 0.406: Q101.1 C103.2
N$7
  Bottom 0.279: IC101.5 52.58,28.19 51.24,29.53 Q101.2
  Bottom 0.406: C102.1 Q101.2
N$9  (via drill 0.7)
  Top 0.406: v47.55,27.23 47.55,25.89 L101.C
  Bottom 0.406: R104.1 49.31,26.48 48.56,27.23 v47.55,27.23
N$10
  Bottom 0.406: R401.2 23.28,9.42 24.45,8.25 T401.1
N$11
  Bottom 0.406: T401.3 R403.1 R402.1
N$12
  Bottom 0.406: R403.2 19.15,6.08 T402.1
N$17
  Bottom 0.279: IC201.6 15.78,27.84 Q201.1
  Bottom 0.406: Q201.1 C203.2
N$18
  Bottom 0.279: IC201.5 15.27,27.91 13.65,29.53 Q201.2
  Bottom 0.406: C202.1 Q201.2
N$20  (via drill 0.7 pad 0.61)
  Top 0.406: v9.35,26.21 9.35,26.95 L201.C
  Bottom 0.406: R204.1 9.84,25.72 v9.35,26.21
N$59
  Bottom 0.279: IC101.31 53.09,9.49 R105.2
N$60
  Bottom 0.279: IC201.31 15.78,9.68 R205.2
ODROID_TX
  Bottom 0.813: J502.6 R401.1
ODROID_TXD
  Bottom 0.406: R205.1 15.88,5.4 18.25,3.03 T402.3 21.56,3.03 22.76,1.83 47.13,1.83 R105.1
PWM1_1  (via drill 0.7)
  Top 0.406: D102.C 48.36,15.24 48.97,15.85 48.97,20.73 49.99,21.74 55.37,21.74 57.3,23.67 v57.3,24.38
  Bottom 0.279: IC101.10 55.09,23.8 55.68,24.38 v57.3,24.38
PWM1_2
  Bottom 0.279: IC201.10 17.79,23.48 18.29,23.98
  Bottom 0.406: D202.C 32.83,13.9 22.76,23.98 18.29,23.98
PWM2_1  (via drill 0.7)
  Top 0.406: D103.C 48.09,13.65 49.78,15.34 49.78,20.32 50.39,20.93 60.35,20.93 v60.76,21.34
  Bottom 0.279: IC101.11 55.6,23.29 55.88,23.57 56.49,23.57 57.91,22.15 59.94,22.15 v60.76,21.34
PWM2_2
  Bottom 0.279: IC201.11 18.29,22.97 18.49,23.16
  Bottom 0.406: D203.C 30.48,15.04 22.35,23.16 18.49,23.16
RST
  Bottom 0.279: IC101.7 53.59,27.38 53.84,27.62 57.89,27.62 C101.1
  Bottom 0.406: C101.1 58.2,26.94 58.93,26.21 59.94,26.21 60.55,25.6 60.55,25.22 D101.A 60.69,23.33 R103.2
RST1
  Bottom 0.279: IC201.7 16.29,26.77 17.14,27.62 22.44,27.62 C201.1
  Bottom 0.406: 22.5,27.68 C201.1 24.74,27.73 D201.A 26.52,27.75 R203.2
SERVO_PWM1
  Top 0.406: J502.3 34.29,9.8 35.56,8.53 40.03,8.53 42.06,10.57 42.06,14.02 43.28,15.24 D102.A
  Bottom 0.61: D202.A 33.02,11.43 J502.3
  Bottom 0.813: R404.1 J502.3
SERVO_PWM2
  Top 0.406: J502.4 31.75,9.91 33.93,7.72 40.44,7.72 42.88,10.16 42.88,13.01 43.48,13.61 44.36,13.61 D103.A
  Bottom 0.61: D203.A 30.48,11.43 J502.4
  Bottom 0.813: R405.1 J502.4
SWCLK1  (via drill 0.7)
  Top 0.61: J501.5 34.29,14.58 v35.36,15.65
  Bottom 0.279: 35.65,15.35 v35.36,15.65 35.97,15.04 38.81,15.04 43.89,9.96 46.47,9.96 47.31,10.79 47.31,13.98 48.68,15.35 IC101.37
SWCLK2  (via drill 0.7)
  Top 0.406: v10.57,13.41 11.58,12.39 22.96,12.39 26.82,16.26 26.82,21.13 27.84,22.15 32.51,22.15 34.29,20.37 J501.6
  Bottom 0.279: IC201.37 11.82,14.66 v10.57,13.41
SWDIO1  (via drill 0.7)
  Top 0.406: 32.51,11.79 38.61,11.79 v39.42,12.6
  Top 0.61: J501.3 31.75,12.55 32.51,11.79
  Bottom 0.279: IC101.34 51.59,10.54 50.25,9.21 42.81,9.21 v39.42,12.6
SWDIO2  (via drill 0.7)
  Top 0.406: v14.43,11.18 22.96,11.18 27.64,15.85 27.64,20.73 28.25,21.34 30.89,21.34 31.75,20.47 J501.4
  Bottom 0.279: IC201.34 14.28,11.32 v14.43,11.18
VDD  (via drill 0.7)
  Top 0.406: L101.A 44.28,25.72 v44.25,25.76
  Bottom 0.279: C204.2 19.58,25.3 19.05,24.77 17.78,24.77 17.28,24.26 IC201.9 17.28,16.38 | C206.2 10.9,11.85 11.75,12.7 12.59,12.7 IC201.36 13.29,15.2 14.47,16.38 14.83,16.38 | C107.2 46.67,22.41 48.25,20.84 IC101.48 51.91,20.84 52.83,19.91 52.83,18.49 | C207.2 10.21,21.97 IC201.48 13.98,20.36 14.83,19.51 14.83,16.38 | C105.2 59.16,13.76 IC101.24 54.45,15.35 52.07,17.73 | 17.28,16.38 18.78,14.88 IC201.24 20.97,14.16 C205.2 | 17.28,16.38 14.83,16.38 | 52.07,17.73 50.6,16.26 IC101.36 50.08,13.88 48.68,12.48 C106.2 | 52.07,17.73 52.83,18.49 | C104.2 56.41,25.53 55.88,24.99 54.86,24.99 54.59,24.71 IC101.9 54.59,21.21 55.27,20.52 55.27,19.1 54.66,18.49 52.83,18.49
  Bottom 0.406: R103.1 58.69,23.33 D101.C 57.74,26.04 C104.2 | C204.2 19.87,25.75 D201.C 26.52,25.75 R203.1 37.68,25.9 38.61,26.82 43.18,26.82 v44.25,25.76 | 43.97,26.04 v44.25,25.76 | C107.2 45.66,24.35 v44.25,25.76
  Bottom 0.61: S202.1 9.53,22.12 C207.2 | S102.1 60.06,13.7 C105.2
  pour Bottom (isolate 0.305): 14.29,16.19 17.46,16.19 17.46,18.41 14.29,18.41
  pour Bottom (isolate 0.305): 51.21,20.12 56.29,20.12 56.29,15.44 51.21,15.44

### Text on the board
Top: Manpads_20180516